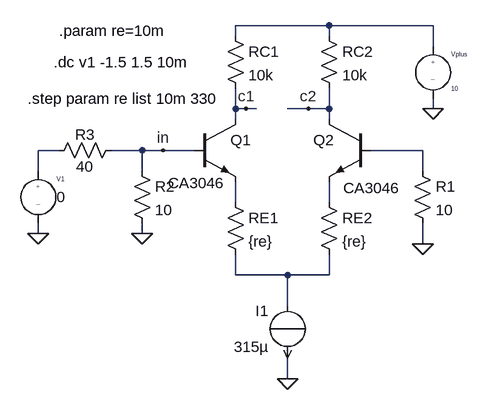
[diagram p0: schematic diff_a2-315.asc]
diff_a2-315.asc, the LTspice schematic file:
Version 4
SHEET 1 952 680
WIRE 448 -32 304 -32
WIRE 608 -32 448 -32
WIRE 304 -16 304 -32
WIRE 448 -16 448 -32
WIRE 608 0 608 -32
WIRE 304 96 304 64
WIRE 320 96 304 96
WIRE 336 96 320 96
WIRE 416 96 384 96
WIRE 448 96 448 64
WIRE 448 96 416 96
WIRE 608 96 608 80
WIRE 304 112 304 96
WIRE 448 112 448 96
WIRE 32 160 0 160
WIRE 160 160 112 160
WIRE 192 160 160 160
WIRE 240 160 192 160
WIRE 592 160 512 160
WIRE 0 192 0 160
WIRE 160 192 160 160
WIRE 592 192 592 160
WIRE 304 240 304 208
WIRE 448 240 448 208
WIRE 0 288 0 272
WIRE 160 288 160 272
WIRE 592 304 592 272
WIRE 304 352 304 320
WIRE 384 352 304 352
WIRE 448 352 448 320
WIRE 448 352 384 352
WIRE 384 400 384 352
WIRE 384 512 384 480
FLAG 592 304 0
FLAG 160 288 0
FLAG 0 288 0
FLAG 608 96 0
FLAG 320 96 c1
FLAG 416 96 c2
FLAG 192 160 in
FLAG 384 512 0
SYMBOL EIT_Semiconductors\\npn 240 112 R0
WINDOW 3 -40 98 Left 2
SYMATTR Value CA3046
SYMATTR InstName Q1
SYMBOL EIT_Semiconductors\\npn 512 112 M0
WINDOW 3 -45 106 Left 2
SYMATTR Value CA3046
SYMATTR InstName Q2
SYMBOL res 288 -32 R0
SYMATTR InstName RC1
SYMATTR Value 10k
SYMBOL res 432 -32 R0
SYMATTR InstName RC2
SYMATTR Value 10k
SYMBOL res 576 176 R0
SYMATTR InstName R1
SYMATTR Value 10
SYMBOL res 144 176 R0
SYMATTR InstName R2
SYMATTR Value 10
SYMBOL res 16 176 R270
WINDOW 0 25 56 VTop 2
WINDOW 3 7 56 VBottom 2
SYMATTR InstName R3
SYMATTR Value 40
SYMBOL source-V 0 176 R0
WINDOW 3 28 56 Left 2
WINDOW 123 0 0 Left 2
WINDOW 39 0 0 Left 2
SYMATTR Value 0
SYMATTR InstName V1
SYMBOL source-V 608 -16 R0
SYMATTR InstName Vplus
SYMATTR Value 10
SYMBOL res 288 224 R0
SYMATTR InstName RE1
SYMATTR Value {re}
SYMBOL res 432 224 R0
SYMATTR InstName RE2
SYMATTR Value {re}
SYMBOL source-I 384 480 R180
WINDOW 0 29 73 Left 2
WINDOW 3 29 17 Left 2
SYMATTR InstName I1
SYMATTR Value 315µ
TEXT 24 24 Left 2 !.dc v1 -1.5 1.5 10m
TEXT 32 -24 Left 2 !.param re=10m
TEXT -16 80 Left 2 !.step param re list 10m 330

The netlist it stands for:
* diff_a2-315.asc
Q1 c1 in N004 0 CA3046
Q2 c2 N003 N005 0 CA3046
RC1 N001 c1 10k
RC2 N001 c2 10k
R1 N003 0 10
R2 in 0 10
R3 N002 in 40
V1 N002 0 0
Vplus N001 0 10
RE1 N004 N006 {re}
RE2 N005 N006 {re}
I1 N006 0 315µ
.model NPN NPN
.model PNP PNP
.lib standard.bjt
.dc v1 -1.5 1.5 10m
.param re=10m
.step param re list 10m 330
.backanno
.end